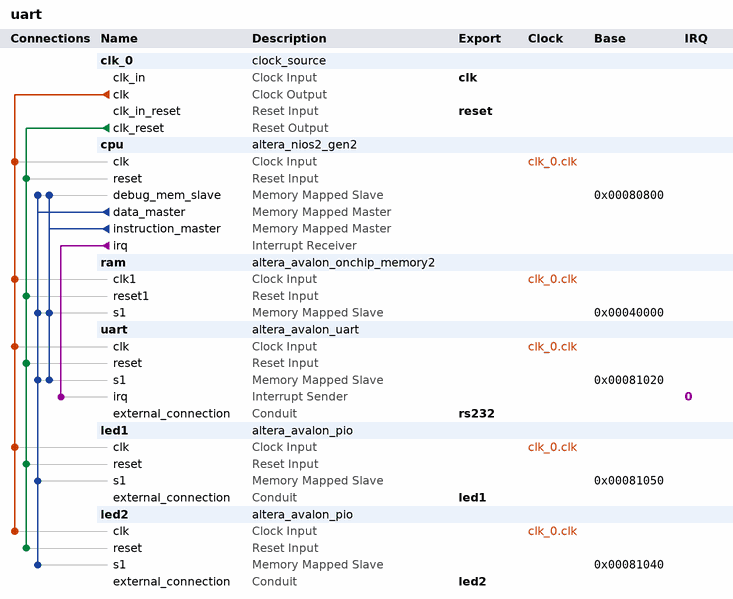
[diagram p0: system contents]
# Platform Designer (Qsys) system uart, Cyclone IV E EP4CE115F29C7
# Parameters at their usual value, and those the tool derives, are not listed.
package require -exact qsys 17.1
create_system uart
set_project_property DEVICE_FAMILY {Cyclone IV E}
set_project_property DEVICE EP4CE115F29C7

add_instance clk_0 clock_source 17.1
set_instance_parameter_value clk_0 clockFrequency 50000000

add_instance cpu altera_nios2_gen2 17.1
set_instance_parameter_value cpu dcache_size 2048
set_instance_parameter_value cpu exceptionSlave ram.s1
set_instance_parameter_value cpu icache_size 4096
set_instance_parameter_value cpu impl Tiny
set_instance_parameter_value cpu resetSlave ram.s1

add_instance ram altera_avalon_onchip_memory2 17.1
set_instance_parameter_value ram dataWidth 32
set_instance_parameter_value ram dualPort false
set_instance_parameter_value ram initMemContent true
set_instance_parameter_value ram initializationFileName onchip_mem.hex
set_instance_parameter_value ram memorySize 204800

add_instance uart altera_avalon_uart 17.1
set_instance_parameter_value uart baud 115200
set_instance_parameter_value uart dataBits 8
set_instance_parameter_value uart fixedBaud true
set_instance_parameter_value uart parity NONE
set_instance_parameter_value uart stopBits 1

add_instance led1 altera_avalon_pio 17.1
set_instance_parameter_value led1 direction Output
set_instance_parameter_value led1 width 1

add_instance led2 altera_avalon_pio 17.1
set_instance_parameter_value led2 direction Output
set_instance_parameter_value led2 width 1

# connections
add_connection clk_0.clk cpu.clk clock
add_connection clk_0.clk led1.clk clock
add_connection clk_0.clk led2.clk clock
add_connection clk_0.clk ram.clk1 clock
add_connection clk_0.clk uart.clk clock
add_connection clk_0.clk_reset cpu.reset reset
add_connection clk_0.clk_reset led1.reset reset
add_connection clk_0.clk_reset led2.reset reset
add_connection clk_0.clk_reset ram.reset1 reset
add_connection clk_0.clk_reset uart.reset reset
add_connection cpu.data_master cpu.debug_mem_slave avalon
set_connection_parameter_value cpu.data_master/cpu.debug_mem_slave baseAddress 0x00080800
add_connection cpu.data_master led1.s1 avalon
set_connection_parameter_value cpu.data_master/led1.s1 baseAddress 0x00081050
add_connection cpu.data_master led2.s1 avalon
set_connection_parameter_value cpu.data_master/led2.s1 baseAddress 0x00081040
add_connection cpu.data_master ram.s1 avalon
set_connection_parameter_value cpu.data_master/ram.s1 baseAddress 0x00040000
add_connection cpu.data_master uart.s1 avalon
set_connection_parameter_value cpu.data_master/uart.s1 baseAddress 0x00081020
add_connection cpu.instruction_master cpu.debug_mem_slave avalon
set_connection_parameter_value cpu.instruction_master/cpu.debug_mem_slave baseAddress 0x00080800
add_connection cpu.instruction_master ram.s1 avalon
set_connection_parameter_value cpu.instruction_master/ram.s1 baseAddress 0x00040000
add_connection cpu.instruction_master uart.s1 avalon
set_connection_parameter_value cpu.instruction_master/uart.s1 baseAddress 0x00081020
add_connection cpu.irq uart.irq interrupt
set_connection_parameter_value cpu.irq/uart.irq irqNumber 0

# exported interfaces
add_interface clk clock sink
set_interface_property clk EXPORT_OF clk_0.clk_in
add_interface led1 conduit end
set_interface_property led1 EXPORT_OF led1.external_connection
add_interface led2 conduit end
set_interface_property led2 EXPORT_OF led2.external_connection
add_interface reset reset sink
set_interface_property reset EXPORT_OF clk_0.clk_in_reset
add_interface rs232 conduit end
set_interface_property rs232 EXPORT_OF uart.external_connection

set_interconnect_requirement {$system} qsys_mm.clockCrossingAdapter HANDSHAKE
set_interconnect_requirement {$system} qsys_mm.enableEccProtection FALSE
set_interconnect_requirement {$system} qsys_mm.insertDefaultSlave FALSE
set_interconnect_requirement {$system} qsys_mm.maxAdditionalLatency 1

save_system uart.qsys
